# EasyEDA Pro project GigaVGA666.eprj

# Schematic Schematic1
Board Name: Board1; Create Date: 2025-10-13; Page Name: P1; Project Name: New Project_2025-10-13_15-06-48; Schematic Name: Schematic1; Update Date: 2025-10-13; Company: EasyEDA.com; Page Size: A4; Version: V1.0
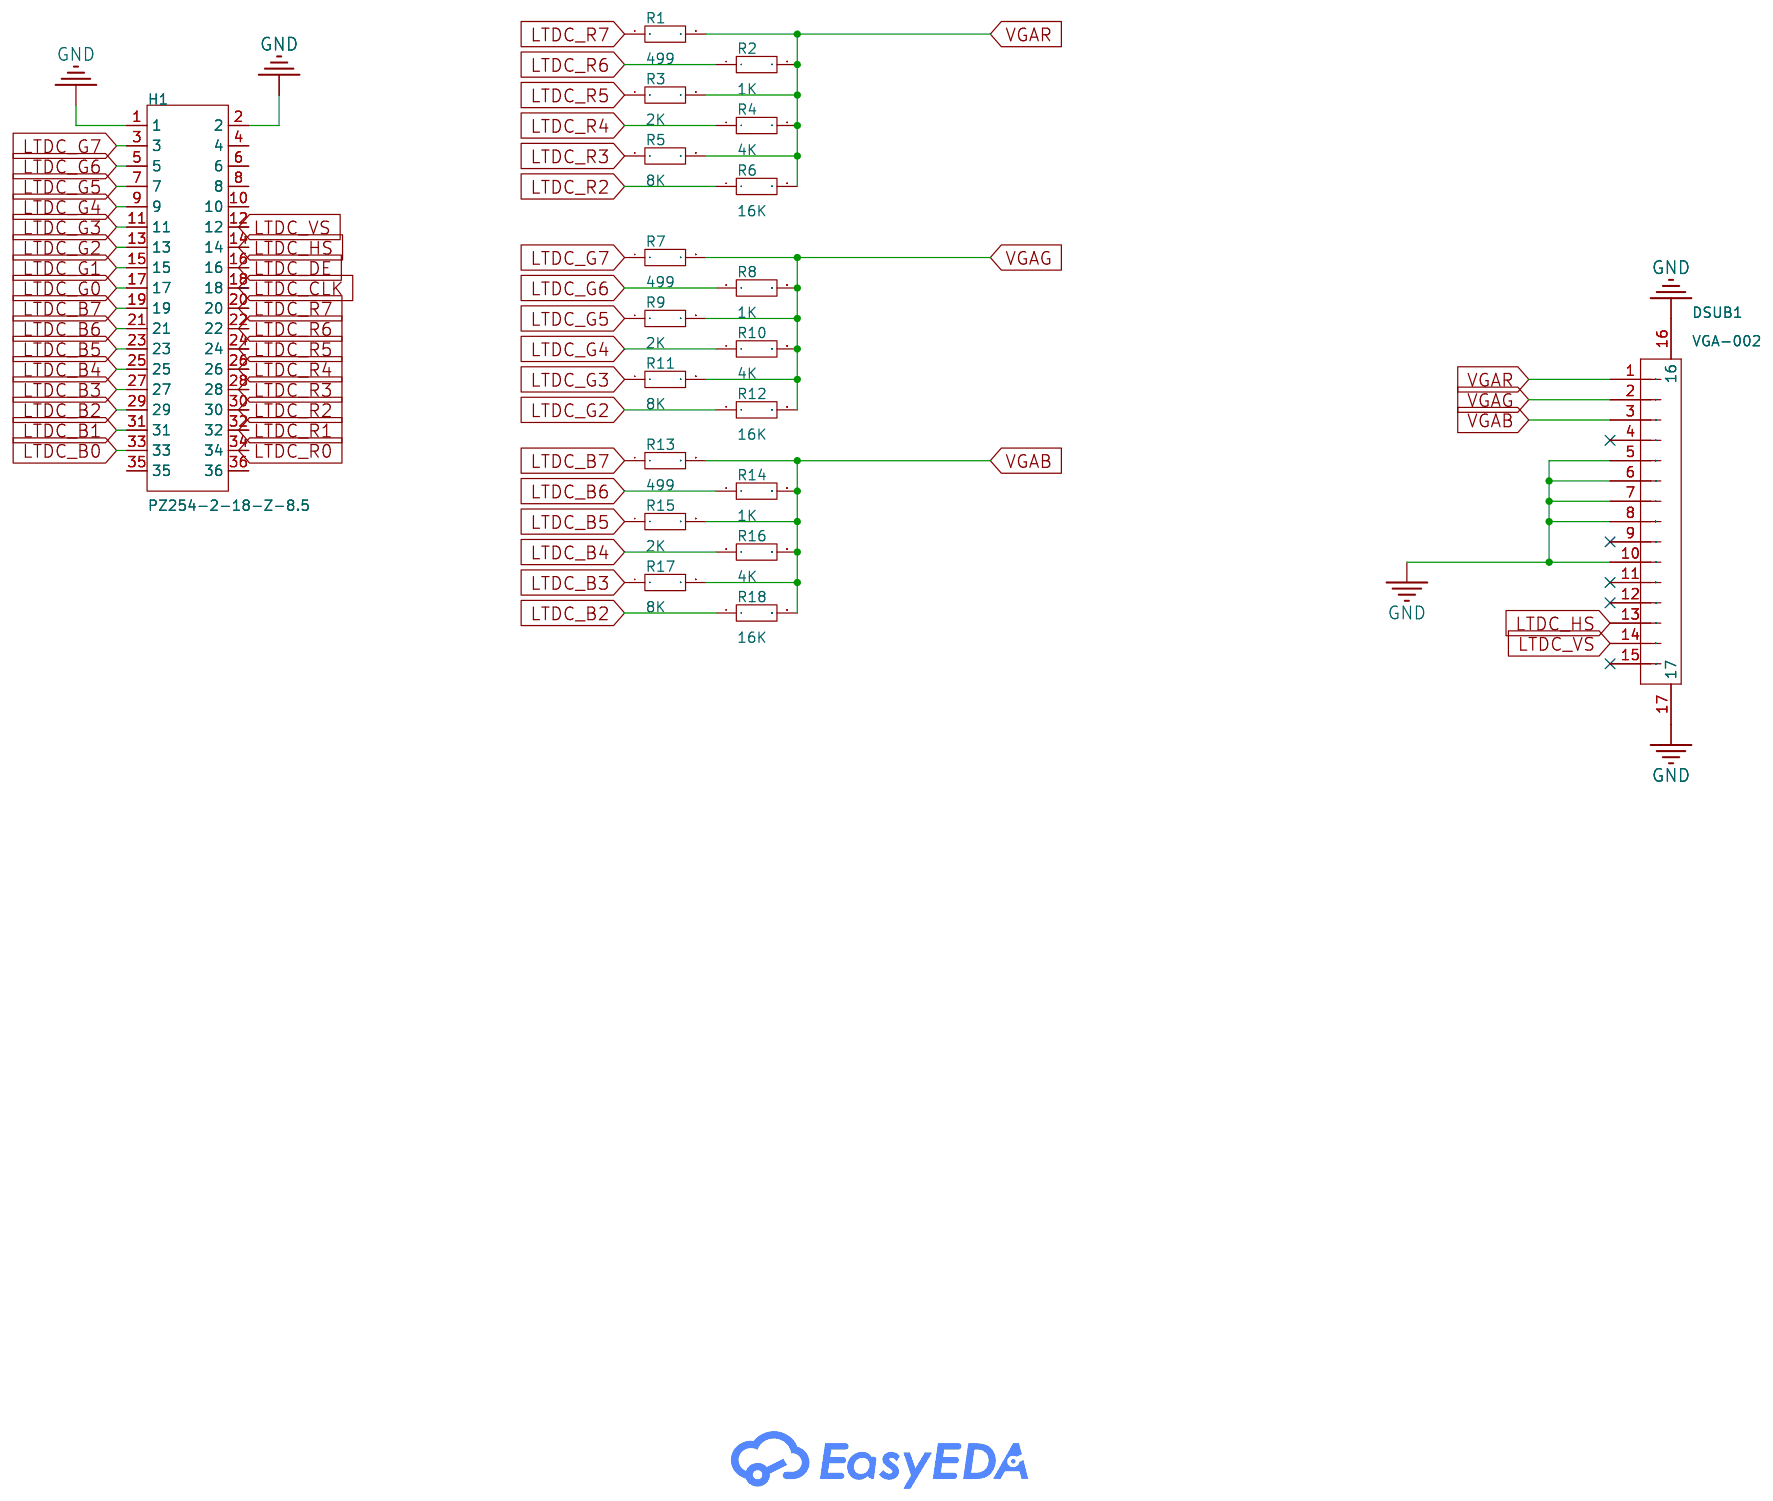
[diagram p0: schematic sheet]

## Parts
DSUB1  VGA-002  [D-SUB-TH_VGA-002]
H1  PZ254-2-18-Z-8.5  [HDR-TH_36P-P2.54-V-M-R2-C18-S2.54]
R1  499  [R0603]
R2  1K  [R0603]
R3  2K  [R0603]
R4  4K  [R0603]
R5  8K  [R0603]
R6  16K  [R0603]
R7  499  [R0603]
R8  1K  [R0603]
R9  2K  [R0603]
R10  4K  [R0603]
R11  8K  [R0603]
R12  16K  [R0603]
R13  499  [R0603]
R14  1K  [R0603]
R15  2K  [R0603]
R16  4K  [R0603]
R17  8K  [R0603]
R18  16K  [R0603]

## Library data of the parts
DSUB1 = VGA-002: LCSC Part Name: D-Sub 母 P数:15P; Supplier Part: C138387; Manufacturer: BOOMELE(博穆精密); Supplier Footprint: 弯插; JLCPCB Part Class: Extended Part; Datasheet: https://item.szlcsc.com/datasheet/VGA-002/149705.html; Supplier: LCSC; Connector Type: High Density D-Sub; Gender: Female; Number of Pins: 15P; Mounting Type: Right Angle; Number of Rows: 3; Current Rating-Signal: 500mA; Voltage Rating: 30V; Color: Blue
H1 = PZ254-2-18-Z-8.5_C2894979: LCSC Part Name: 2x18P 间距:2.54mm 方针 直插; Supplier Part: C2894979; Manufacturer: HCTL(华灿天禄); Supplier Footprint: 插件,P=2.54mm; JLCPCB Part Class: Extended Part; Datasheet: https://atta.szlcsc.com/upload/public/pdf/source/20230609/5BA09C8BEB9B31376F8BF6032FF67CAC.pdf; Supplier: LCSC; Pin Structure: 2x18P; Pitch: 2.54mm; Row Spacing: 2.54mm; Circluar Pins/Square Pins: Policy; Mounting Type: Straight; Number of Rows: Double Row; Number of Pins: 36P; Current Rating: 3A; Length of Mating Pin: 6mm; Insulation Height: 2.5mm; Length of End Connection Pin: 3mm; Contact Material: Brass; Operating Temperature: -40℃~+105℃; Color: Black
R1-R18 = Res_0603: Supplier Footprint: 0603

## Nets
GND: DSUB1.5 DSUB1.6 DSUB1.7 DSUB1.8 DSUB1.10 DSUB1.16 DSUB1.17 H1.1 H1.2
LTDC_B0: H1.33
LTDC_B1: H1.31
LTDC_B2: H1.29 R18.1
LTDC_B3: H1.27 R17.1
LTDC_B4: H1.25 R16.1
LTDC_B5: H1.23 R15.1
LTDC_B6: H1.21 R14.1
LTDC_B7: H1.19 R13.1
LTDC_CLK: H1.18
LTDC_DE: H1.16
LTDC_G0: H1.17
LTDC_G1: H1.15
LTDC_G2: H1.13 R12.1
LTDC_G3: H1.11 R11.1
LTDC_G4: H1.9 R10.1
LTDC_G5: H1.7 R9.1
LTDC_G6: H1.5 R8.1
LTDC_G7: H1.3 R7.1
LTDC_HS: DSUB1.13 H1.14
LTDC_R0: H1.34
LTDC_R1: H1.32
LTDC_R2: H1.30 R6.1
LTDC_R3: H1.28 R5.1
LTDC_R4: H1.26 R4.1
LTDC_R5: H1.24 R3.1
LTDC_R6: H1.22 R2.1
LTDC_R7: H1.20 R1.1
LTDC_VS: DSUB1.14 H1.12
VGAB: DSUB1.3 R13.2 R14.2 R15.2 R16.2 R17.2 R18.2
VGAG: DSUB1.2 R7.2 R8.2 R9.2 R10.2 R11.2 R12.2
VGAR: DSUB1.1 R1.2 R2.2 R3.2 R4.2 R5.2 R6.2

Not connected (* = marked no-connect by the designer): DSUB1 4* 9* 11* 12* 15*; H1 4 6 8 10 35 36

# Board PCB1
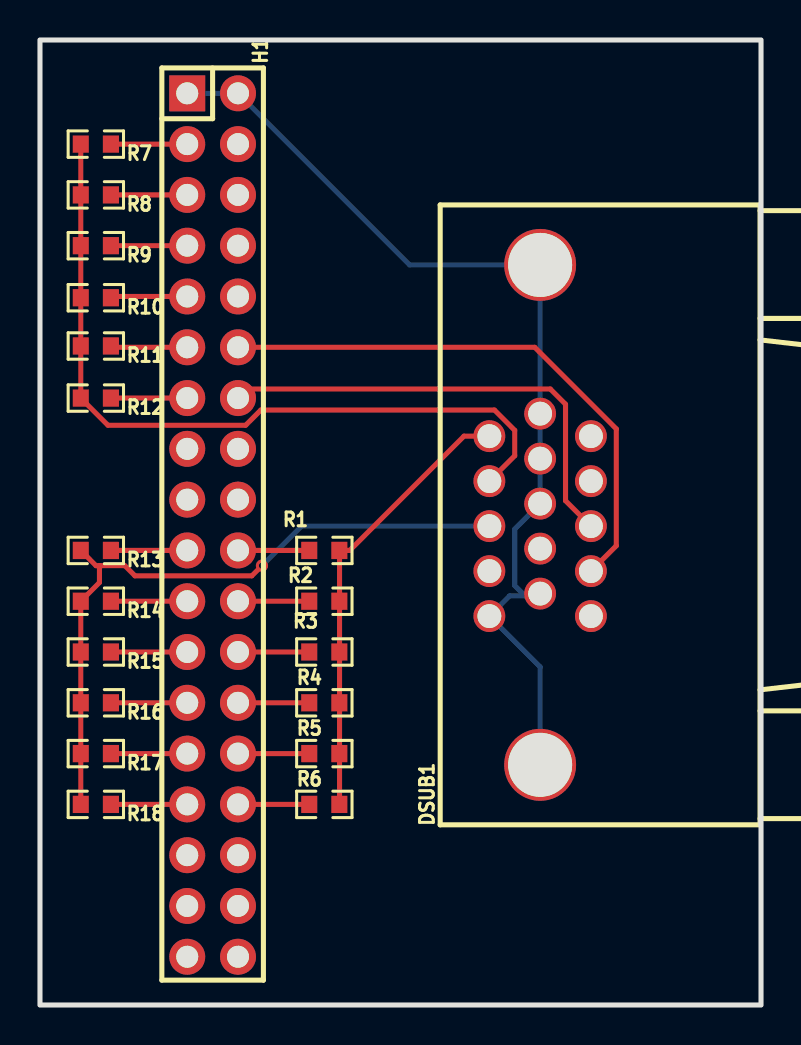
[diagram p1: board, top side]
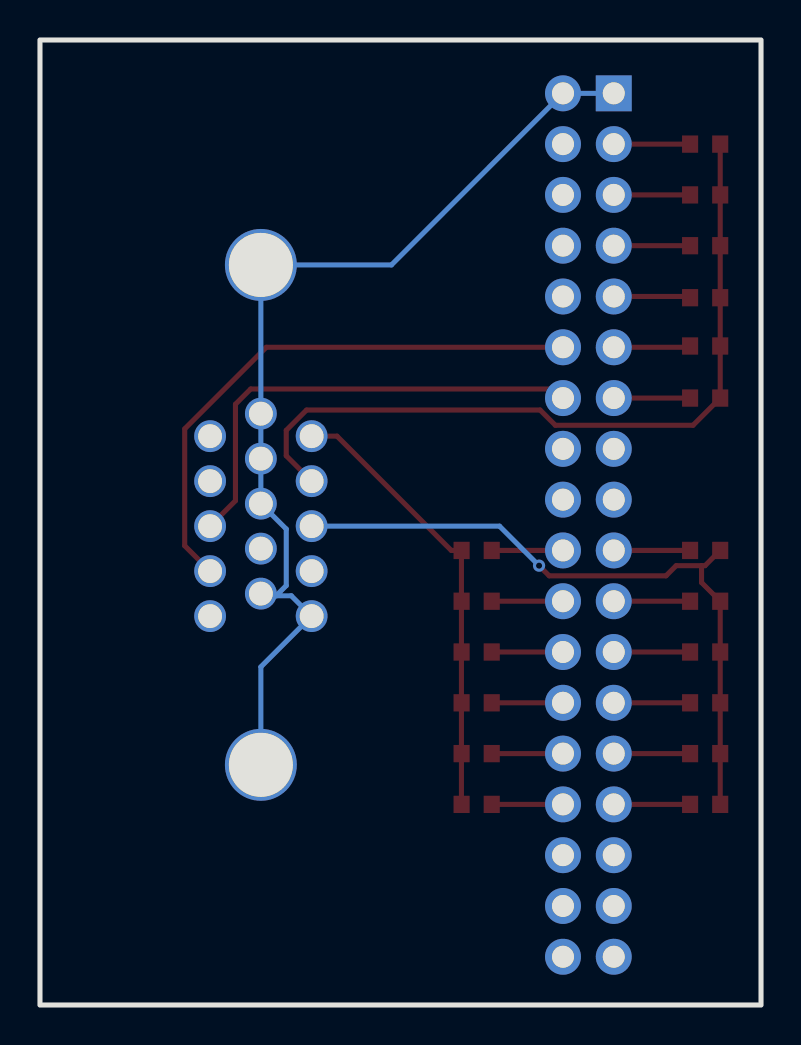
[diagram p2: board, bottom side, seen from below]

Outline 36.07 x 48.26 mm; copper layers: Top Layer, Bottom Layer. Coordinates in mm from the lower left corner of the outline.
Outline path: rectangle 0,48.26 36.07,0
Stack: Top Layer 0.035mm / Dielectric1 1.51mm FR4 er 4.5 / Bottom Layer 0.035mm

## Design rules (mm)
template: Custom Config
spacing copperThickness1oz (default): track to track 0.102, other pairs 0.152 to 0.3
spacing copperThickness2oz: track to track 0.203, other pairs 0.152 to 0.3
track width copperThickness1oz (default): min 0.127, default 0.254, max 2.54
track width copperThickness2oz: min 0.127, default 0.254, max 2.54
differential pair differentialPair (default): width min 0.127, default 0.254, max 2.54; gap min 0.152, default 0.152
via viaSize (default): diameter min 0.5, default 0.61, max 10; hole min 0.3, default 0.305, max 6.3
net GND uses copperThickness2oz

## Placement (name value [footprint] x y rotation side)
DSUB1  VGA-002  [D-SUB-TH_VGA-002]  25.02 24.51 90 top
H1  PZ254-2-18-Z-8.5  [HDR-TH_36P-P2.54-V-M-R2-C18-S2.54]  8.64 24 270 top
R1  499  [R0603]  14.22 22.73 0 top
R2  1K  [R0603]  14.22 20.19 0 top
R3  2K  [R0603]  14.22 17.65 0 top
R4  4K  [R0603]  14.22 15.11 0 top
R5  8K  [R0603]  14.22 12.57 0 top
R6  16K  [R0603]  14.22 10.03 0 top
R7  499  [R0603]  2.79 43.05 180 top
R8  1K  [R0603]  2.79 40.51 180 top
R9  2K  [R0603]  2.79 37.97 180 top
R10  4K  [R0603]  2.79 35.37 180 top
R11  8K  [R0603]  2.79 32.96 180 top
R12  16K  [R0603]  2.79 30.35 180 top
R13  499  [R0603]  2.79 22.73 180 top
R14  1K  [R0603]  2.79 20.19 180 top
R15  2K  [R0603]  2.79 17.65 180 top
R16  4K  [R0603]  2.79 15.11 180 top
R17  8K  [R0603]  2.79 12.57 180 top
R18  16K  [R0603]  2.79 10.03 180 top

## Footprints (pads in the part's own frame, mm; a bottom-side part is the same pattern mirrored in y, then rotated)
D-SUB-TH_VGA-002
  round 1.593 hole 1.194: 1(3.938,2.54) 2(1.688,2.54) 3(-0.562,2.54) 4(-2.812,2.54) 5(-5.062,2.54) 6(5.062,0) 7(2.812,0) 8(0.562,0) 9(-1.688,0) 10(-3.938,0) 11(3.938,-2.54) 12(1.688,-2.54) 13(-0.562,-2.54) 14(-2.812,-2.54) 15(-5.062,-2.54)
  round 3.599 hole 3.2: 16(12.5,0) 17(-12.5,0)
HDR-TH_36P-P2.54-V-M-R2-C18-S2.54
  rect 1.8x1.8 hole 1.1: 1(-21.59,-1.27)
  round 1.8 hole 1.1: 2(-21.59,1.27) 3(-19.05,-1.27) 4(-19.05,1.27) 5(-16.51,-1.27) 6(-16.51,1.27) 7(-13.97,-1.27) 8(-13.97,1.27) 9(-11.43,-1.27) 10(-11.43,1.27) 11(-8.89,-1.27) 12(-8.89,1.27) 13(-6.35,-1.27) 14(-6.35,1.27) 15(-3.81,-1.27) 16(-3.81,1.27) 17(-1.27,-1.27) 18(-1.27,1.27) 19(1.27,-1.27) 20(1.27,1.27) 21(3.81,-1.27) 22(3.81,1.27) 23(6.35,-1.27) 24(6.35,1.27) 25(8.89,-1.27) 26(8.89,1.27) 27(11.43,-1.27) 28(11.43,1.27) 29(13.97,-1.27) 30(13.97,1.27) 31(16.51,-1.27) 32(16.51,1.27) 33(19.05,-1.27) 34(19.05,1.27) 35(21.59,-1.27) 36(21.59,1.27)
R0603
  rect 0.806x0.864 smd: 1(-0.753,0) 2(0.753,0)

## Nets
As in the schematic.

Pads without a net: DSUB1 4 9 11 12 15; H1 4 6 8 10 35 36

## Via types
v1: diameter 0.61, hole 0.305, Top Layer to Bottom Layer, 1 via

## Routing (per net, layer and track width the routed paths; a pad name or vN(x,y) marks a point on that pad's centre or on a via; arc(x,y) is an arc through that point)
GND: length 50
  Bottom Layer w0.254: H1.1 H1.2 18.49,37.01 DSUB1.16 DSUB1.6 DSUB1.7 DSUB1.8 23.75,23.8 23.75,20.97 24.26,20.46 ; 24.26,20.46 24.91,20.46 DSUB1.10 ; 24.26,20.46 23.5,20.46 DSUB1.5 25.02,16.91 DSUB1.17
LTDC_B2: length 3.8
  Top Layer w0.254: H1.29 R18.1
LTDC_B3: length 3.8
  Top Layer w0.254: H1.27 R17.1
LTDC_B4: length 3.8
  Top Layer w0.254: H1.25 R16.1
LTDC_B5: length 3.8
  Top Layer w0.254: H1.23 R15.1
LTDC_B6: length 3.8
  Top Layer w0.254: H1.21 R14.1
LTDC_B7: length 3.8
  Top Layer w0.254: H1.19 R13.1
LTDC_G2: length 3.8
  Top Layer w0.254: H1.13 R12.1
LTDC_G3: length 3.8
  Top Layer w0.254: R11.1 3.61,32.89 H1.11
LTDC_G4: length 3.8
  Top Layer w0.254: R10.1 3.61,35.43 H1.9
LTDC_G5: length 3.8
  Top Layer w0.254: H1.7 R9.1
LTDC_G6: length 3.8
  Top Layer w0.254: H1.5 R8.1
LTDC_G7: length 3.8
  Top Layer w0.254: H1.3 R7.1
LTDC_HS: length 23.5
  Top Layer w0.254: H1.14 10.36,30.81 25.53,30.81 26.29,30.04 26.29,25.22 DSUB1.13
LTDC_R2: length 3.6
  Top Layer w0.254: H1.30 R6.1
LTDC_R3: length 3.6
  Top Layer w0.254: H1.28 R5.1
LTDC_R4: length 3.6
  Top Layer w0.254: H1.26 R4.1
LTDC_R5: length 3.6
  Top Layer w0.254: H1.24 R3.1
LTDC_R6: length 3.6
  Top Layer w0.254: H1.22 R2.1
LTDC_R7: length 3.6
  Top Layer w0.254: H1.20 R1.1
LTDC_VS: length 28.3
  Top Layer w0.254: H1.12 24.75,32.89 28.83,28.81 28.83,22.97 DSUB1.14
VGAB: length 34.3
  Top Layer w0.254: 2.98,21.97 2.8,21.97 R13.2 ; 2.98,21.97 2.98,21.13 R14.2 R15.2 R16.2 R17.2 R18.2 ; 2.98,21.97 4.25,21.97 4.75,21.46 10.6,21.46 v1(11.1,21.97)
  Bottom Layer w0.254: DSUB1.3 13.08,23.95 v1(11.1,21.97)
VGAG: length 38.8
  Top Layer w0.254: R7.2 R8.2 R9.2 R10.2 R11.2 R12.2 3.4,28.99 10.29,28.99 11.05,29.75 22.73,29.75 23.75,28.74 23.75,27.47 DSUB1.2
VGAR: length 22.6
  Top Layer w0.254: 14.99,22.73 14.99,20.2 14.98,20.19 R2.2 ; 14.99,22.73 15.49,22.73 21.21,28.45 DSUB1.1 ; 14.99,22.73 R1.2 ; 14.99,20.19 14.99,17.66 14.98,17.65 R3.2 ; 14.99,17.65 14.99,15.12 14.98,15.11 R4.2 ; 14.99,12.57 14.99,10.04 R6.2 ; 14.99,15.11 14.99,12.58 14.98,12.57 R5.2
